# Altium schematic sheet Microcontroller_Power.SchDoc: Microcontroller Power
size A4; DrawnBy: J. Wilson & M. Small; SheetNumber: 3; SheetTotal: 10
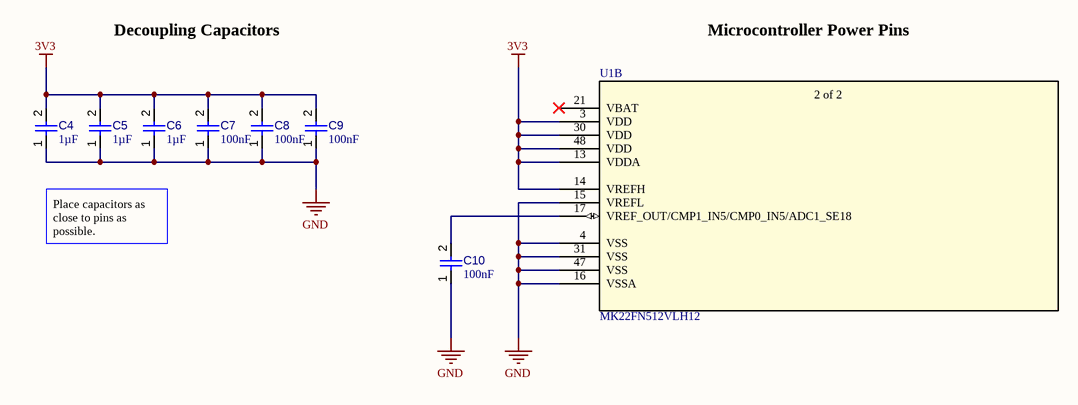
[diagram p0: Microcontroller_Power.SchDoc]

## Parts
C4  value 1µF  [CAPC0805(2012)145_L]  (hidden comment: Capacitor 1µF +/-20% 25V 0805)
C5  value 1µF  [CAPC0805(2012)145_L]  (hidden comment: Capacitor 1µF +/-20% 25V 0805)
C6  value 1µF  [CAPC0805(2012)145_L]  (hidden comment: Capacitor 1µF +/-20% 25V 0805)
C7  value 100nF  [CAPC0805(2012)145_L]  (hidden comment: Capacitor 100nF +/-20% 25V 0805)
C8  value 100nF  [CAPC0805(2012)145_L]  (hidden comment: Capacitor 100nF +/-20% 25V 0805)
C9  value 100nF  [CAPC0805(2012)145_L]  (hidden comment: Capacitor 100nF +/-20% 25V 0805)
C10  value 100nF  [CAPC0805(2012)145_L]  (hidden comment: Capacitor 100nF +/-20% 25V 0805)
U1  MK22FN512VLH12  [LQFP-64_10X10X1.6_NXP]  (part B of 2)

## Nets
3V3: C4.2 C5.2 C6.2 C7.2 C8.2 C9.2 U1.3(VDD) U1.13(VDDA) U1.14(VREFH) U1.30(VDD) U1.48(VDD)
GND: C4.1 C5.1 C6.1 C7.1 C8.1 C9.1 C10.1 U1.4(VSS) U1.15(VREFL) U1.16(VSSA) U1.31(VSS) U1.47(VSS)
NetC10_2: C10.2 U1.17(VREF_OUT/CMP1_IN5/CMP0_IN5/ADC1_SE18)

Not connected (* = marked no-connect by the designer): U1 21(VBAT)*

## Notes on the sheet
- Decoupling Capacitors
- Microcontroller Power Pins
- Place capacitors as close to pins as possible.
- Date:
- Sheet
- of
- Time:
- Revision:
- Drawn by:
- File:
- (in symbol MK22FN512VLH12, part B) 2 of 2

## Library data of the parts
C4-C6 = CMP-001-00079-2: Chip Capacitor, 1µF +/-20%, 25V, 0805, Thickness 1.45 mm; Tolerance: 10%; Pins: 2; Max Operating Temperature: 85°C; Mounting Technology: SMT; Case/Package: 0805; Voltage Rating: 25V; Min Operating Temperature: -55°C
C7-C10 = CMP-001-00079-2: Chip Capacitor, 100nF +/-20%, 25V, 0805, Thickness 1.45 mm; Tolerance: 10%; Pins: 2; Max Operating Temperature: 85°C; Mounting Technology: SMT; Case/Package: 0805; Voltage Rating: 25V; Min Operating Temperature: -55°C
U1 = MK22FN512VLH12: No Description Available; SourceLibrary: NXP_2015-03-30; Pin_Count: 64; SRAM_KB: 128; Flash_KB: 512; Max_Frequency: 120; CPU: ARM Cortex-M4F; Vendor: NXP; Copyright: Copyright (C) 2016 Accelerated Designs. All rights reserved; Package: LQFP; Manufacturer_Part_Number: MK22FN512VLH12; RefDes: RefDes; Type: DEV